# Altium schematic sheet Motor.SchDoc
size A2
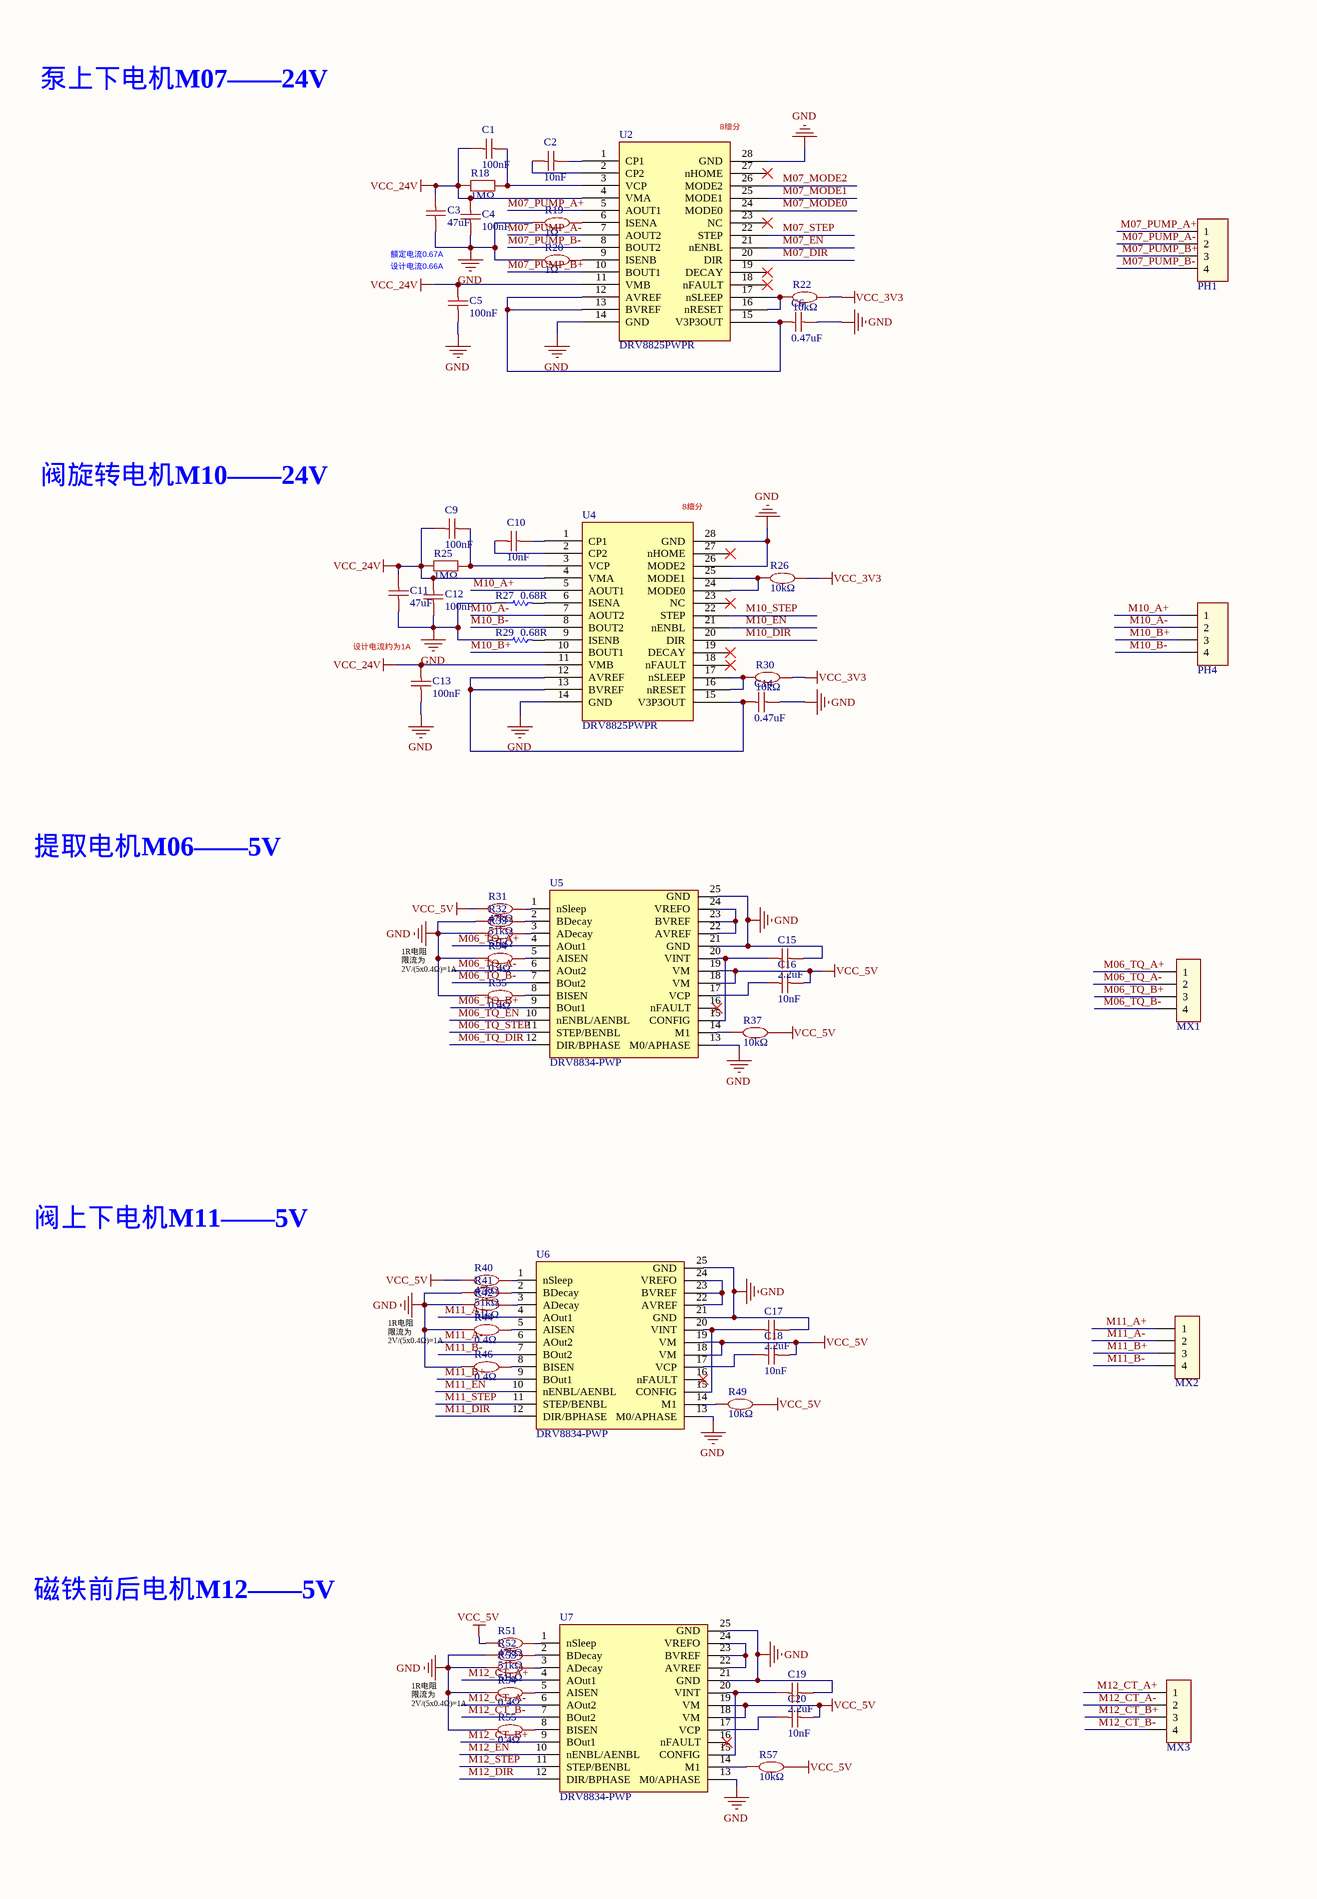
[diagram p0: Motor.SchDoc, left]
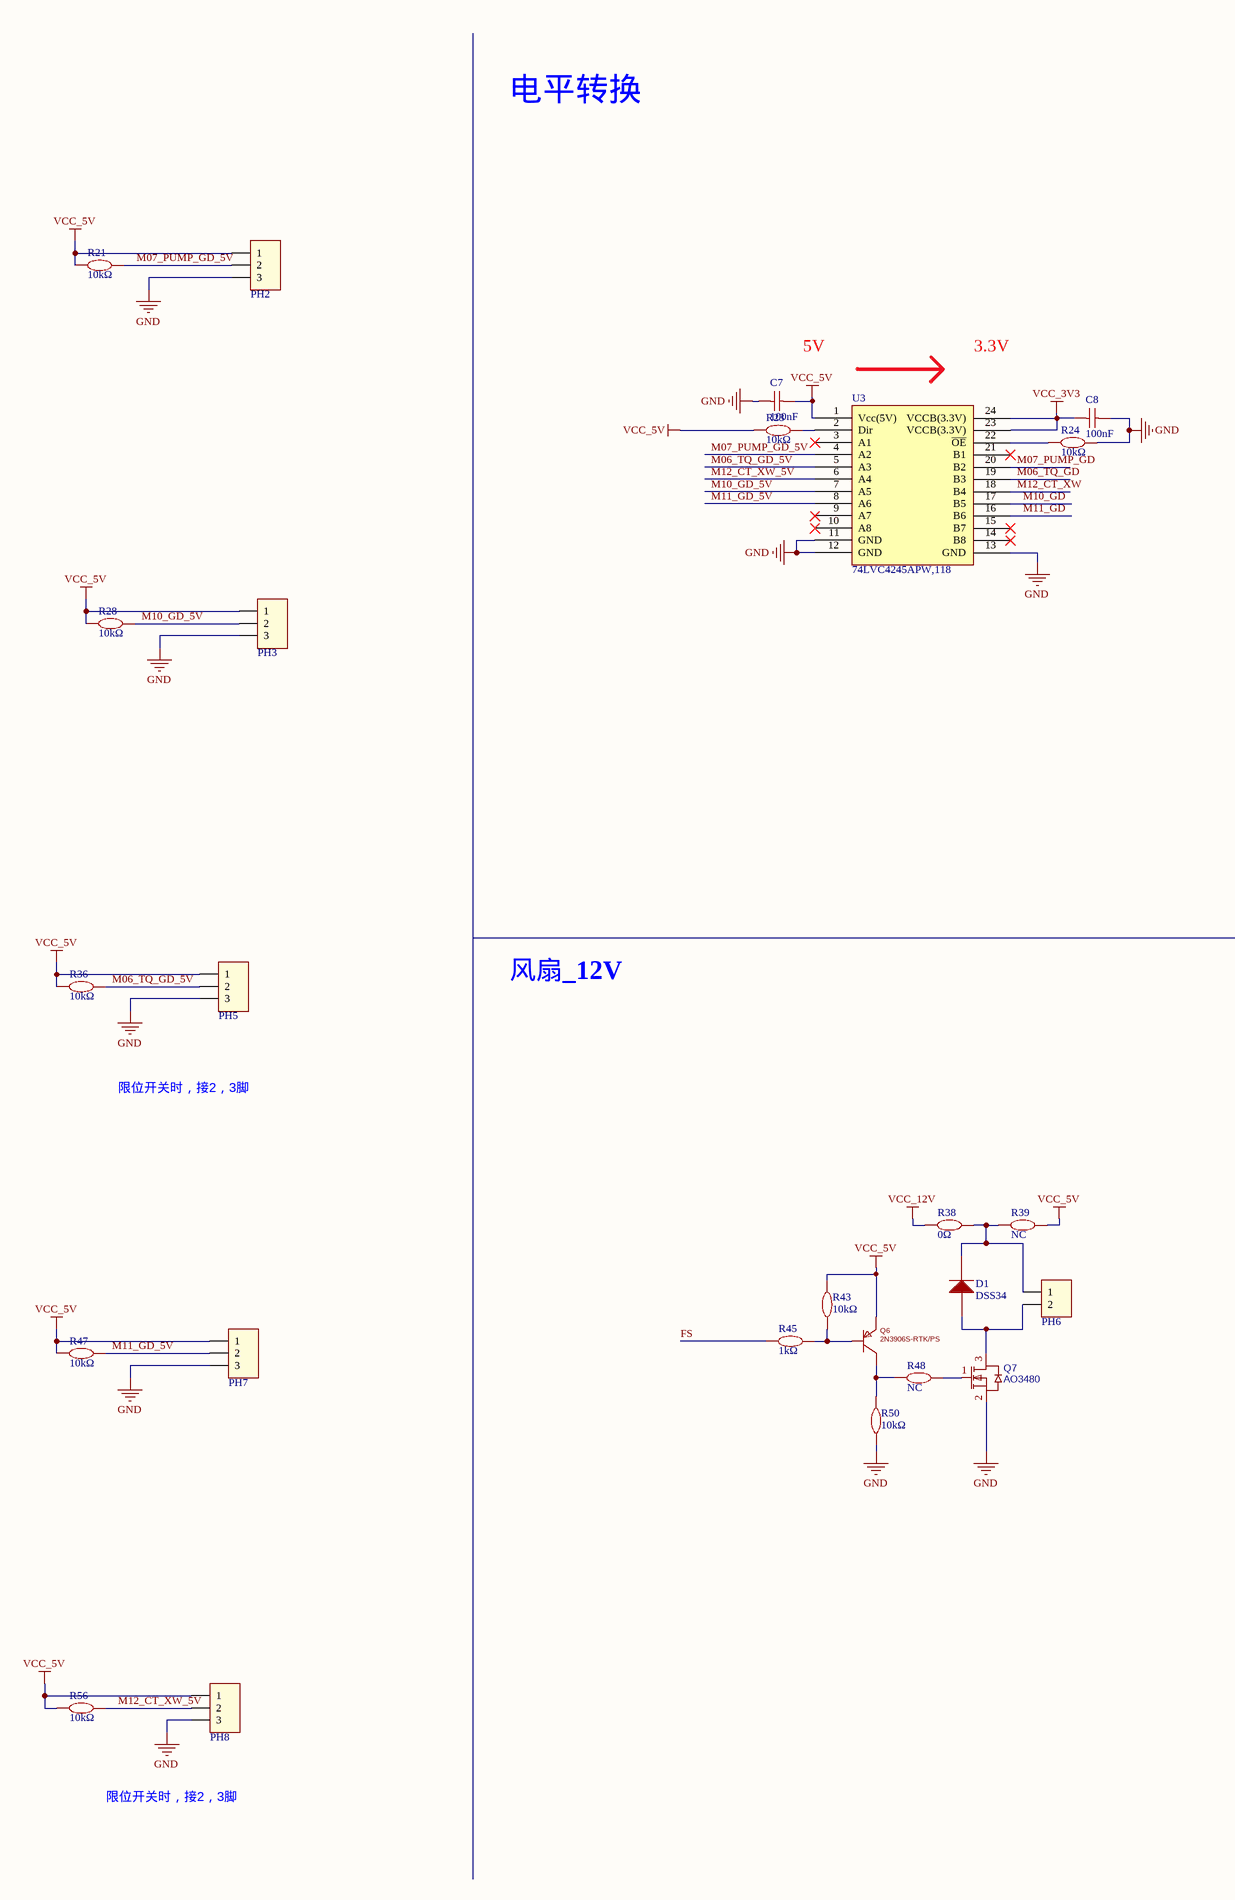
[diagram p1: Motor.SchDoc, right]

## Parts
C1  100nF  [C0603]
C2  10nF  [C0603]
C3  47uF  [C1210]
C4  100nF  [C0603]
C5  100nF  [C0603]
C6  0.47uF  [C0603]
C7  100nF  [C0603]
C8  100nF  [C0603]
C9  100nF  [C0603]
C10  10nF  [C0603]
C11  47uF  [C1210]
C12  100nF  [C0603]
C13  100nF  [C0603]
C14  0.47uF  [C0603]
C15  2.2uF  [C0603]
C16  10nF  [C0603]
C17  2.2uF  [C0603]
C18  10nF  [C0603]
C19  2.2uF  [C0603]
C20  10nF  [C0603]
D1  DSS34  [SOD-123]
MX1  MX1.25-4P  [CONN-TH_4P-P1.25_HCTL_HC-1.25-4AW]  (value not drawn)
MX2  MX1.25-4P  [CONN-TH_4P-P1.25_HCTL_HC-1.25-4AW]  (value not drawn)
MX3  MX1.25-4P  [CONN-TH_4P-P1.25_HCTL_HC-1.25-4AW]  (value not drawn)
PH1  PH2.0-4P  [PH2.0-4P 弯针]  (value not drawn)
PH2  PH2.0-3P  [PH2.0-3P 弯针]  (value not drawn)
PH3  PH2.0-3P  [PH2.0-3P 弯针]  (value not drawn)
PH4  PH2.0-4P  [PH2.0-4P 弯针]  (value not drawn)
PH5  PH2.0-3P  [PH2.0-3P 弯针]  (value not drawn)
PH6  PH2.0-2P  [PH2.0-2P 弯针]  (value not drawn)
PH7  PH2.0-3P  [PH2.0-3P 弯针]  (value not drawn)
PH8  PH2.0-3P  [PH2.0-3P 弯针]  (value not drawn)
Q6  2N3906S-RTK/PS  [SOT-23-3_L2.9-W1.3-P1.90-LS2.4-TR]
Q7  AO3480  [SOT-23(SOT-23-3)]
R18  1MΩ  [R0603]
R19  1Ω  [R0603]
R20  1Ω  [R0603]
R21  10kΩ  [R0603]
R22  10kΩ  [R0603]
R23  10kΩ  [R0603]
R24  10kΩ  [R0603]
R25  1MΩ  [R0603]
R26  10kΩ  [R0603]
R27  0.68R  [R0603]
R28  10kΩ  [R0603]
R29  0.68R  [R0603]
R30  10kΩ  [R0603]
R31  47kΩ  [R0603]
R32  51kΩ  [R0603]
R33  51kΩ  [R0603]
R34  0.4Ω  [R0603]
R35  0.4Ω  [R0603]
R36  10kΩ  [R0603]
R37  10kΩ  [R0603]
R38  0Ω  [R0603]
R39  NC  [R0603]
R40  47kΩ  [R0603]
R41  51kΩ  [R0603]
R42  51kΩ  [R0603]
R43  10kΩ  [R0603]
R44  0.4Ω  [R0603]
R45  1kΩ  [R0603]
R46  0.4Ω  [R0603]
R47  10kΩ  [R0603]
R48  NC  [R0603]
R49  10kΩ  [R0603]
R50  10kΩ  [R0603]
R51  47kΩ  [R0603]
R52  51kΩ  [R0603]
R53  51kΩ  [R0603]
R54  0.4Ω  [R0603]
R55  0.4Ω  [R0603]
R56  10kΩ  [R0603]
R57  10kΩ  [R0603]
U2  DRV8825PWPR  [HTSSOP-28]
U3  74LVC4245APW,118  [TSSOP-24]
U4  DRV8825PWPR  [HTSSOP-28]
U5  DRV8834-PWP  [HTSSOP-24]
U6  DRV8834-PWP  [HTSSOP-24]
U7  DRV8834-PWP  [HTSSOP-24]

## Nets
GND: C3.1 C4.1 C5.1 C6.2 C7.1 C8.2 C11.1 C12.1 C13.1 C14.2 C15.1 C17.1 C19.1 PH2.3 PH3.3 PH5.3 PH7.3 PH8.3 Q7.2(S) R19.1 R20.1 R24.1 R27.1 R29.1 R32.2 R33.2 R34.2 R35.2 R41.2 R42.2 R44.2 R46.2 R50.1 R52.2 R53.2 R54.2 R55.2 U2.14(GND) U2.28(GND) U3.11(GND) U3.12(GND) U3.13(GND) U4.14(GND) U4.26(MODE2) U4.28(GND) U5.13(M0/APHASE) U5.21(GND) U5.25(GND) U6.13(M0/APHASE) U6.21(GND) U6.25(GND) U7.13(M0/APHASE) U7.21(GND) U7.25(GND)
VCC_3V3: C8.1 R22.2 R26.2 R30.2 U3.23(VCCB(3.3V)) U3.24(VCCB(3.3V))
VCC_5V: C7.2 C16.1 C18.1 C20.1 PH2.1 PH3.1 PH5.1 PH7.1 PH8.1 Q6.1(E) R21.2 R23.2 R28.2 R31.2 R36.2 R37.1 R39.2 R40.2 R43.2 R47.2 R49.1 R51.2 R56.1 R57.1 U3.1(Vcc(5V)) U5.18(VM) U5.19(VM) U6.18(VM) U6.19(VM) U7.18(VM) U7.19(VM)
VCC_12V: R38.1
VCC_24V: C1.1 C3.2 C4.2 C5.2 C9.1 C11.2 C12.2 C13.2 R18.1 R25.1 U2.4(VMA) U2.11(VMB) U4.4(VMA) U4.11(VMB)
FS: R45.2
M06_TQ_A+: MX1.1 U5.4(AOut1)
M06_TQ_A-: MX1.2 U5.6(AOut2)
M06_TQ_B+: MX1.3 U5.9(BOut1)
M06_TQ_B-: MX1.4 U5.7(BOut2)
M06_TQ_DIR: U5.12(DIR/BPHASE)
M06_TQ_EN: U5.10(nENBL/AENBL)
M06_TQ_GD: U3.19(B3)
M06_TQ_GD_5V: PH5.2 R36.1 U3.5(A3)
M06_TQ_STEP: U5.11(STEP/BENBL)
M07_DIR: U2.20(DIR)
M07_EN: U2.21(nENBL)
M07_MODE0: U2.24(MODE0)
M07_MODE1: U2.25(MODE1)
M07_MODE2: U2.26(MODE2)
M07_PUMP_A+: PH1.1 U2.5(AOUT1)
M07_PUMP_A-: PH1.2 U2.7(AOUT2)
M07_PUMP_B+: PH1.3 U2.10(BOUT1)
M07_PUMP_B-: PH1.4 U2.8(BOUT2)
M07_PUMP_GD: U3.20(B2)
M07_PUMP_GD_5V: PH2.2 R21.1 U3.4(A2)
M07_STEP: U2.22(STEP)
M10_A+: PH4.1 U4.5(AOUT1)
M10_A-: PH4.2 U4.7(AOUT2)
M10_B+: PH4.3 U4.10(BOUT1)
M10_B-: PH4.4 U4.8(BOUT2)
M10_DIR: U4.20(DIR)
M10_EN: U4.21(nENBL)
M10_GD: U3.17(B5)
M10_GD_5V: PH3.2 R28.1 U3.7(A5)
M10_STEP: U4.22(STEP)
M11_A+: MX2.1 U6.4(AOut1)
M11_A-: MX2.2 U6.6(AOut2)
M11_B+: MX2.3 U6.9(BOut1)
M11_B-: MX2.4 U6.7(BOut2)
M11_DIR: U6.12(DIR/BPHASE)
M11_EN: U6.10(nENBL/AENBL)
M11_GD: U3.16(B6)
M11_GD_5V: PH7.2 R47.1 U3.8(A6)
M11_STEP: U6.11(STEP/BENBL)
M12_CT_A+: MX3.1 U7.4(AOut1)
M12_CT_A-: MX3.2 U7.6(AOut2)
M12_CT_B+: MX3.3 U7.9(BOut1)
M12_CT_B-: MX3.4 U7.7(BOut2)
M12_CT_XW: U3.18(B4)
M12_CT_XW_5V: PH8.2 R56.2 U3.6(A4)
M12_DIR: U7.12(DIR/BPHASE)
M12_EN: U7.10(nENBL/AENBL)
M12_STEP: U7.11(STEP/BENBL)
NetC1_2: C1.2 R18.2 U2.3(VCP)
NetC2_1: C2.1 U2.2(CP2)
NetC2_2: C2.2 U2.1(CP1)
NetC6_1: C6.1 U2.12(AVREF) U2.13(BVREF) U2.15(V3P3OUT)
NetC9_2: C9.2 R25.2 U4.3(VCP)
NetC10_1: C10.1 U4.2(CP2)
NetC10_2: C10.2 U4.1(CP1)
NetC14_1: C14.1 U4.12(AVREF) U4.13(BVREF) U4.15(V3P3OUT)
NetC15_2: C15.2 U5.15(CONFIG) U5.20(VINT)
NetC16_2: C16.2 U5.17(VCP)
NetC17_2: C17.2 U6.15(CONFIG) U6.20(VINT)
NetC18_2: C18.2 U6.17(VCP)
NetC19_2: C19.2 U7.15(CONFIG) U7.20(VINT)
NetC20_2: C20.2 U7.17(VCP)
NetD1_1: D1.1(A) PH6.2 Q7.3(D)
NetD1_2: D1.2(K) PH6.1 R38.2 R39.1
NetQ6_2: Q6.2(B) R43.1 R45.1
NetQ6_3: Q6.3(C) R48.1 R50.2
NetQ7_1: Q7.1(G) R48.2
NetR19_2: R19.2 U2.6(ISENA)
NetR20_2: R20.2 U2.9(ISENB)
NetR22_1: R22.1 U2.16(nRESET) U2.17(nSLEEP)
NetR23_1: R23.1 U3.2(Dir)
NetR24_2: R24.2 U3.22(~{OE})
NetR26_1: R26.1 U4.24(MODE0) U4.25(MODE1)
NetR27_2: R27.2 U4.6(ISENA)
NetR29_2: R29.2 U4.9(ISENB)
NetR30_1: R30.1 U4.16(nRESET) U4.17(nSLEEP)
NetR31_1: R31.1 U5.1(nSleep)
NetR32_1: R32.1 U5.2(BDecay)
NetR33_1: R33.1 U5.3(ADecay)
NetR34_1: R34.1 U5.5(AISEN)
NetR35_1: R35.1 U5.8(BISEN)
NetR37_2: R37.2 U5.14(M1)
NetR40_1: R40.1 U6.1(nSleep)
NetR41_1: R41.1 U6.2(BDecay)
NetR42_1: R42.1 U6.3(ADecay)
NetR44_1: R44.1 U6.5(AISEN)
NetR46_1: R46.1 U6.8(BISEN)
NetR49_2: R49.2 U6.14(M1)
NetR51_1: R51.1 U7.1(nSleep)
NetR52_1: R52.1 U7.2(BDecay)
NetR53_1: R53.1 U7.3(ADecay)
NetR54_1: R54.1 U7.5(AISEN)
NetR55_1: R55.1 U7.8(BISEN)
NetR57_2: R57.2 U7.14(M1)
NetU5_22: U5.22(AVREF) U5.23(BVREF) U5.24(VREFO)
NetU6_22: U6.22(AVREF) U6.23(BVREF) U6.24(VREFO)
NetU7_22: U7.22(AVREF) U7.23(BVREF) U7.24(VREFO)

Not connected (* = marked no-connect by the designer): U2 18(nFAULT)* 19(DECAY)* 23(NC)* 27(nHOME)*; U3 3(A1)* 9(A7)* 10(A8)* 14(B8)* 15(B7)* 21(B1)*; U4 18(nFAULT)* 19(DECAY)* 23(NC)* 27(nHOME)*; U5 16(nFAULT)*; U6 16(nFAULT)*; U7 16(nFAULT)*

## Notes on the sheet
- 泵上下电机M07——24V
- (near U2) 8细分
- 电平转换
- 额定电流0.67A
- 设计电流0.66A
- 5V
- 3.3V
- 阀旋转电机M10——24V
- (near U4) 8细分
- 设计电流约为1A
- 提取电机M06——5V
- 1R电阻限流为2V/(5x0.4Ω)=1A
- 风扇_12V
- 限位开关时，接2，3脚
- 阀上下电机M11——5V
- 磁铁前后电机M12——5V
- Title
- Size:
- Date:
- File:
- A2
- Number:
- Time:
- Revision:
- Sheet
- of

## Library data of the parts
C1 C4 C5 C7-C9 C12 C13 = 100nF/50V,C0603: 贴片电容,X7R; ComponentLink1Description: 供应商链接; ComponentLink1URL: http://www.szlcsc.com/product/details_16531.html
C2 C10 C16 C18 C20 = 10nF/50V,C0603: 贴片电容,X7R; ComponentLink1Description: 供应商链接; ComponentLink1URL: http://www.szlcsc.com/product/details_16531.html
C3 C11 = 47uF/25V,C1210: 贴片电容,X7R; ComponentLink1Description: 供应商链接; ComponentLink1URL: http://www.szlcsc.com/product/details_2206.html
C6 C14 = 0.47uF/50V,C0603: 贴片电容,X7R; ComponentLink1Description: 供应商链接; ComponentLink1URL: http://www.szlcsc.com/product/details_16531.html
C15 C17 C19 = 2.2uF/50V,C0603: 贴片电容,X7R; ComponentLink1Description: 供应商链接; ComponentLink1URL: http://www.szlcsc.com/product/details_16531.html
D1 = DSS34,SOD-123: 肖特基二极管; ComponentLink1Description: 供应商链接; ComponentLink1URL: http://www.szlcsc.com/product/details_9093.html
Q6 = 2N3906S-RTK/PS: Manufacturer: KEC; Symbol: 2N3906S-RTK/PS_C5300004; Add into BOM: yes; Current - Collector(Ic): 200mA; Collector - Emitter Voltage VCEO: 40V; Pd - Power Dissipation: 350mW; DC Current Gain: 300@10mA,1V; Transition frequency(fT): 250MHz; Current - Collector Cutoff: 50nA; Vce Saturation(VCE(sat)): 400mV@50mA,5mA; Emitter-Base Voltage(Vebo): 5V; Device: 2N3906S-RTK/PS; LCSC Part Name: 2N3906S-RTK/PS; Supplier Part: C5300004; Manufacturer Part: 2N3906S-RTK/PS; Supplier Footprint: SOT-23; JLCPCB Part Class: Extended Part; Datasheet: https://item.szlcsc.com/datasheet/2N3906S-RTK%252FPS/6051230.html; Supplier: LCSC; Convert to PCB: yes
Q7 = AO3480: 场效应管(MOSFET)；漏源电压(Vdss) 30V；连续漏极电流(Id) 5.8A；导通电阻(RDS(on)) 41mΩ@10V,5.8A；耗散功率(Pd) 1.4W；阈值电压(Vgs(th)) 1.4V；栅极电荷量(Qg) 9.5nC@15V；输入电容(Ciss@Vds) 820pF@15V；反向传输电容(Crss) 77pF
R18 R25 = 1MΩ,R0603: 贴片电阻; ComponentLink1Description: 供应商链接; ComponentLink1URL: http://www.szlcsc.com/product/details_23662.html
R19 R20 = 1Ω,R0603: 贴片电阻
R21-R24 R26 R28 R30 R36 R37 R43 R47 R49 R50 R56 R57 = 10kΩ,R0603: 电阻类型:厚膜电阻;阻值:10kΩ;精度:±1%;功率:100mW;最大工作电压:75V;温度系数:±100ppm/℃;
R27 R29 = Res: Resistor; Published: 8-Jun-2000; LatestRevisionDate: 17-Jul-2002; LatestRevisionNote: Re-released for DXP Platform.; PackageReference: AXIAL-0.3; Publisher: Altium Limited
R31 R40 R51 = 47kΩ,R0603: 贴片电阻
R32 R33 R41 R42 R52 R53 = 51kΩ,R0603: 电阻类型:厚膜电阻;阻值:51kΩ;精度:±1%;功率:100mW;最大工作电压:75V;温度系数:±100ppm/℃;
R34 R35 R44 R46 R54 R55 = 0.4Ω,R0603: 贴片电阻
R38 = 0Ω,R0603: 贴片电阻
R39 R48 = NC,R0603
R45 = 1kΩ,R0603: 电阻类型:厚膜电阻;阻值:1kΩ;精度:±1%;功率:125mW;最大工作电压:150V;温度系数:±100ppm/℃;
U3 = 74LVC4245APW: 转换器/电平移位器；通道类型 双向；工作电压(VCCA) 1.5V~5.5V；工作电压(VCCB) 1.5V~3.6V； 通道数 1； / 每个电路通道数 8；输出类型 三态